# Altium project Inteli_led_toy.PrjPcb
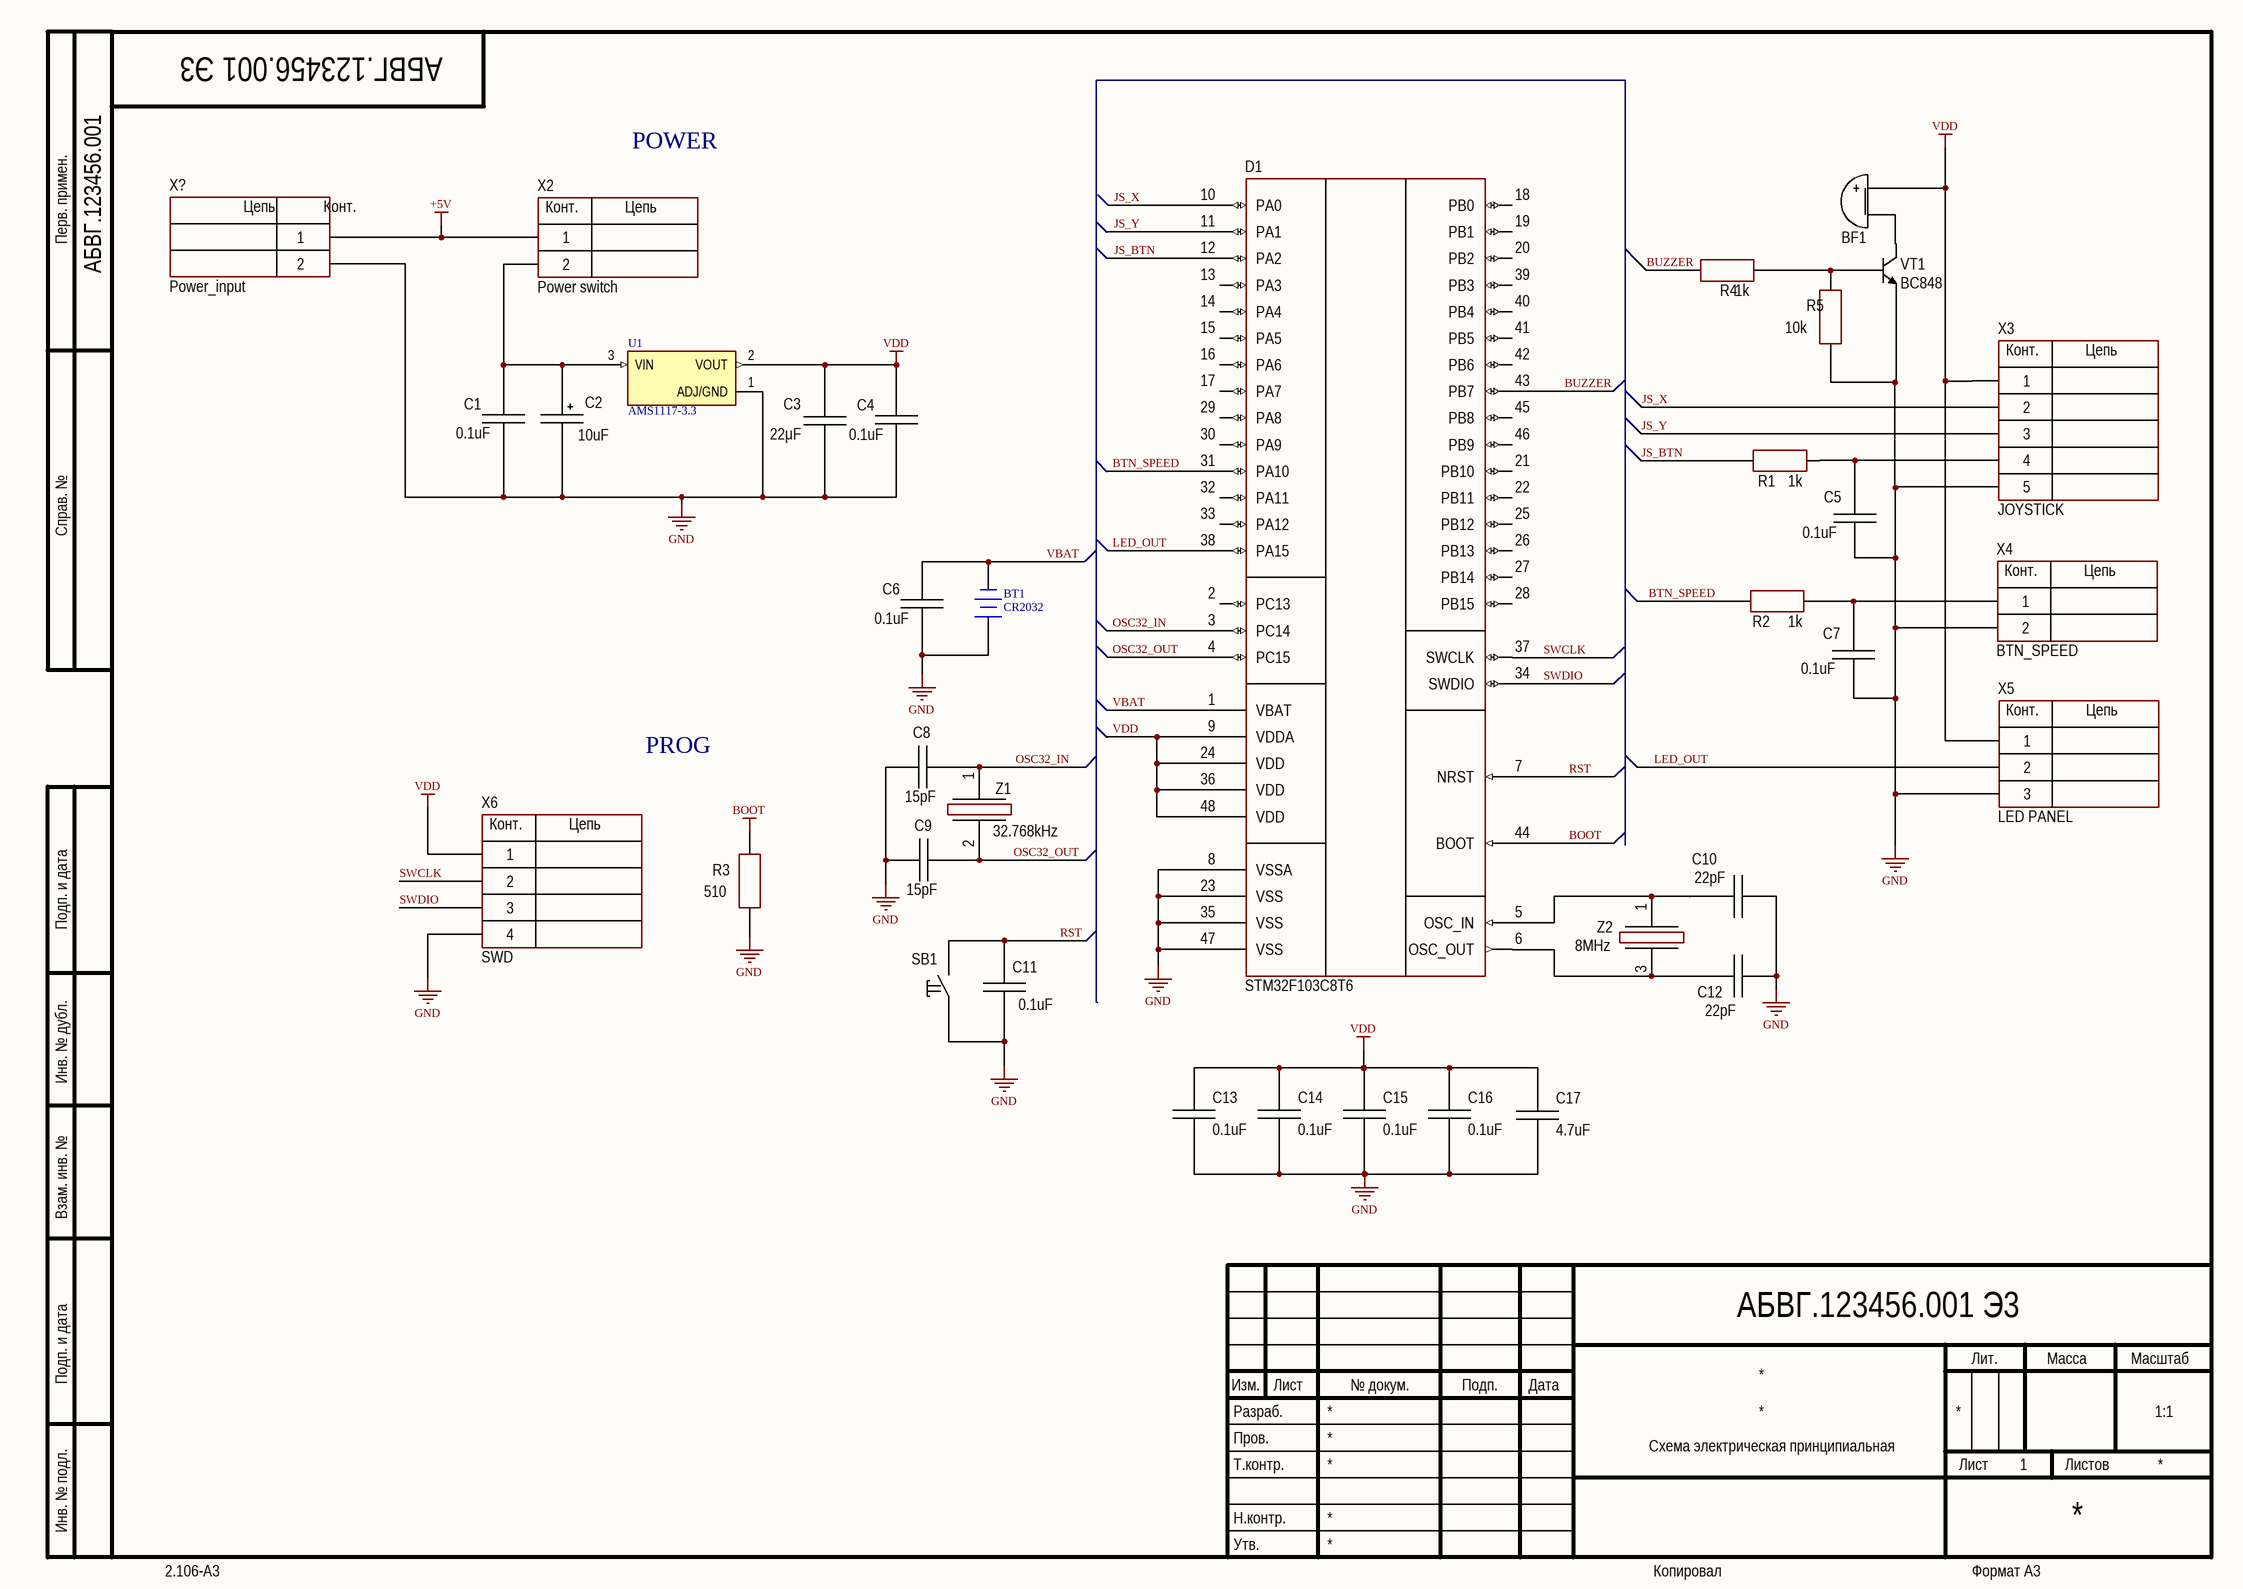
[diagram p0: Sheet1.SchDoc]
1 sheet, 36 parts. Net scope: global (net labels, ports and power ports of the same name join across sheets).
Board file: PCB1.PcbDoc

## Sheet Sheet1.SchDoc
size 420 x 297 mm; Address1: Address1; Address2: Address2; Address3: Address3; Address4: Address4; DocumentNumber: АБВГ.123456.001 Э3; SheetNumber: 1; Scale: 1:1; DocumentType: Схема электрическая принципиальная; FirstReferrence: АБВГ.123456.001

### Parts
BF1  (no value)  [BUZ: AT-0927-TT-6-R]
BT1  CR2032  [BAT-2]
C1  value 0.1uF  [CAP: 1206]
C2  10uF  [D5C2H11]
C3  value 22μF  [CAP: TANTAL-D]
C4  value 0.1uF  [CAP: 1206]
C5  value 0.1uF  [CAP: 1206]
C6  value 0.1uF  [CAP: 1206]
C7  value 0.1uF  [CAP: 1206]
C8  15pF  [CH1206C]
C9  15pF  [CH1206C]
C10  22pF  [CH1206C]
C11  0.1uF  [CH1206C]
C12  22pF  [CH1206C]
C13  value 0.1uF  [CAP: 1206]
C14  value 0.1uF  [CAP: 1206]
C15  value 0.1uF  [CAP: 1206]
C16  value 0.1uF  [CAP: 1206]
C17  value 4.7uF  [CAP: 1206]
D1  (no value)  [48-LQFP]
R1  1k  [CH1206R]
R2  1k  [CH1206R]
R3  510  [CH1206R]
R4  1k  [CH1206R]
R5  10k  [CH1206R]
SB1  "Кнопка"  [BUT: SKQGADE010]  (value not drawn)
U1  AMS1117-3.3  [SOT229P700X180-4N]
VT1  BC848  [SOT23_123]
X2  Power switch  [CON: PLS-2]
X3  JOYSTICK  [CON: PLS-5]
X4  BTN_SPEED  [CON: PLS-2]
X5  LED PANEL  [CON: PLS-3]
X6  SWD  [CON: PLS-4]
X?  Power_input  [CON: PLS-2]
Z1  Frequency: 32.768kHz  [OSC: 3215]
Z2  8MHz  [OSC: 3215]

### Nets
+5V: X2.1 X?.1
BOOT: D1.44(BOOT) R3.2
GND: BT1.1(+) C1.1 C2.2 C3.1 C4.1 C5.1 C6.1 C7.1 C8.2 C9.2 C10.1 C11.1 C12.1 C13.1 C14.1 C15.1 C16.1 C17.1 D1.8(VSSA) D1.23(VSS) D1.35(VSS) D1.47(VSS) R3.1 R5.1 SB1.1 U1.1(ADJ/GND) VT1.3(E) X3.5 X4.2 X5.3 X6.4 X?.2
VDD: BF1.1(+) C3.2 C4.2 C13.2 C14.2 C15.2 C16.2 C17.2 D1.9(VDDA) D1.24(VDD) D1.36(VDD) D1.48(VDD) U1.2(VOUT) X3.1 X5.1 X6.1
BTN_SPEED: D1.31(PA10) R2.2
BUZZER: D1.43(PB7) R4.2
JS_BTN: D1.12(PA2) R1.2
JS_X: D1.10(PA0) X3.2
JS_Y: D1.11(PA1) X3.3
LED_OUT: D1.38(PA15) X5.2
OSC32_IN: C8.1 D1.3(PC14) Z1.1
OSC32_OUT: C9.1 D1.4(PC15) Z1.2
RST: C11.2 D1.7(NRST) SB1.2
SWCLK: D1.37(SWCLK) X6.2
SWDIO: D1.34(SWDIO) X6.3
VBAT: BT1.2(-) C6.2 D1.1(VBAT)
NetBF1_2: BF1.2(-) VT1.2(C)
NetC1_2: C1.2 C2.1 U1.3(VIN) X2.2
NetC5_2: C5.2 R1.1 X3.4
NetC7_2: C7.2 R2.1 X4.1
NetC10_2: C10.2 D1.5(OSC_IN) Z2.1
NetC12_2: C12.2 D1.6(OSC_OUT) Z2.3
NetR4_1: R4.1 R5.2 VT1.1(B)

Not connected (* = marked no-connect by the designer): D1 2(PC13) 13(PA3) 14(PA4) 15(PA5) 16(PA6) 17(PA7) 18(PB0) 19(PB1) 20(PB2) 21(PB10) 22(PB11) 25(PB12) 26(PB13) 27(PB14) 28(PB15) 29(PA8) 30(PA9) 32(PA11) 33(PA12) 39(PB3) 40(PB4) 41(PB5) 42(PB6) 45(PB8) 46(PB9)

### Notes on the sheet
- POWER
- PROG
- Перв. примен.
- Справ. №
- Подп. и дата
- Инв. № дубл.
- Взам. инв. №
- Разраб.
- Изм.
- Лист
- № докум.
- Подп.
- Дата
- Лит.
- Масса
- Масштаб
- Пров.
- Т.контр.
- Листов
- Инв. № подл.
- Утв.
- Н.контр.
- 2.106-A3
- Копировал
- Формат А3
- (in symbol 2-Connector) Конт.; Цепь
- (in symbol 3-Connector) Конт.; Цепь
- (in symbol 4-Connector) Конт.; Цепь
- (in symbol 5-Connector) Конт.; Цепь

### Library data of the parts
BF1 = Buzzer: Manufacturer: PUI Audio; ValueManufacturerPartNumber: DIP switch, 2.73 kHz, 3VDC, 80mA, -20...+70°C; PartNumber: AT-0927-TT-6-R; TypeBuzzer: DIP switch; VoltageMax: 3VDC; Frequency: 2.73 kHz; CurrentMax: 80mA; HelpURL: https://www.digikey.com/products/en?keywords=AT-0927-TT-6-R; Temperature: -20...+70°C
BT1 = Battery: Multicell Battery; Published: 24-Mar-1999; LatestRevisionDate: 17-Jul-2002; LatestRevisionNote: Re-released for DXP Platform.; PackageReference: BAT-2; Publisher: Altium Limited; PackageDescription: Battery; 2 Leads
C1 C4-C7 C13-C16 = Ceramic_1206: Manufacturer: Yageo; PartNumber: CC1206KRX7R9BB104; ValueManufacturerPartNumber: Ceramic capacitor, 0.1uF, X7R, ±10%, 50V, 1206, -55...+125°C; TypeCapacitor: Ceramic capacitor; Tolerance: ±10%; TypeDielectric: X7R; Voltage: 50V; Package: 1206; HelpURL: https://www.digikey.com/product-detail/en/yageo/CC1206KRX7R9BB104/311-1179-1-ND/303089; Temperature: -55...+125°C
C2 = AlumCap: Manufacturer: *; Model: *; HelpURL: *; ComponentKind: *; Value: *
C3 = Tantal_D: Manufacturer: AVX; PartNumber: TAJD476M035RNJV; ValueManufacturerPartNumber: Tantalum capacitor, 22μF, 35V, ±20%, 900mOhm, case D (7343), -55...+125°C; Impedance: 900mOhm; Tolerance: ±20%; TypeDielectric: X7R; TypeCapacitor: Tantalum capacitor; Voltage: 35V; Package: case D (7343); HelpURL: https://www.digikey.com/product-detail/en/avx-corporation/TAJD476M035RNJV/478-12122-1-ND/8605695; Temperature: -55...+125°C
C8-C12 = Capacitor: Manufacturer: *; Model: *; HelpURL: *; ComponentKind: *; Value: *
C17 = Ceramic_1206: Manufacturer: Yageo; PartNumber: CC1206KRX7R9BB104; ValueManufacturerPartNumber: Ceramic capacitor, 4.7uF, X7R, ±10%, 50V, 1206, -55...+125°C; TypeCapacitor: Ceramic capacitor; Tolerance: ±10%; TypeDielectric: X7R; Voltage: 50V; Package: 1206; HelpURL: https://www.digikey.com/product-detail/en/yageo/CC1206KRX7R9BB104/311-1179-1-ND/303089; Temperature: -55...+125°C
D1 = STM32F103C8T6: Cortex-M3; Manufacturer: STMicroelectronics; ValueManufacturerPartNumber: IC microcontroller, 32-Bit, Cortex-M3, 72MHz, 64KB, 20KB, 2...3.6V, -40...+85°C, 48-LQFP; Supply: 2...3.6V; Speed: 72MHz; CoreSize: 32-Bit; MemoryROM: 64KB; MemoryRAM: 20KB; HelpURL: https://www.digikey.com/product-detail/en/stmicroelectronics/STM32F103C8T6TR/497-17666-1-ND/7804402; Package: 48-LQFP; ComponentType: IC microcontroller; Temperature: -40...+85°C; CoreProcessor: Cortex-M3; PartNumber: STM32F103C8T6
R1-R5 = Resistor: Manufacturer: *; Model: *; HelpURL: *; ComponentKind: *; Value: *
SB1 = Tactile switches: 6x6 mm; Manufacturer: *; Model: *; HelpURL: *; ComponentKind: *
U1 = AMS1117-3.3: Sot223/Pkg 1-Amp 3.3-Volt Low Drop Out Voltage Regulatator; MF: Advanced Monolithic Systems; Price: None; Package: None; Value: *; MP: AMS1117-3.3; Availability: Unavailable; SnapEDA_Link: https://www.snapeda.com/parts/AMS1117-3.3/Advanced%20Monolithic%20Systems/view-part/53450/?ref=snap
VT1 = NPN: Bipolar; Model: *; Manufacturer: *; ComponentKind: *; HelpURL: *
X2 X4 X? = 2-Connector: Model: *; Manufacturer: *; HelpURL: *; ComponentKind: *
X3 = 5-Connector: Model: *; Manufacturer: *; HelpURL: *; ComponentKind: *
X5 = 3-Connector: Model: *; Manufacturer: *; HelpURL: *; ComponentKind: *
X6 = 4-Connector: Model: *; Manufacturer: *; HelpURL: *; ComponentKind: *
Z1 = Crystal_3215: Manufacturer: Epson; PartNumber: FC-135 32.7680KA-A5; ValueManufacturerPartNumber: Crystal, 32.768kHz, 12.5pF, ±20ppm, case 3215, -40...+85°C; LoadCapacitance: 12.5pF; Tolerance: ±20ppm; Package: case 3215; HelpURL: https://www.digikey.com/product-detail/en/epson/FC-135-32.7680KA-A5/SER4103CT-ND/6188447; Temperature: -40...+85°C; TypeOscilator: Crystal
Z2 = Oscillator: Manufacturer: *; Model: *; HelpURL: *; ComponentKind: *; Value: *